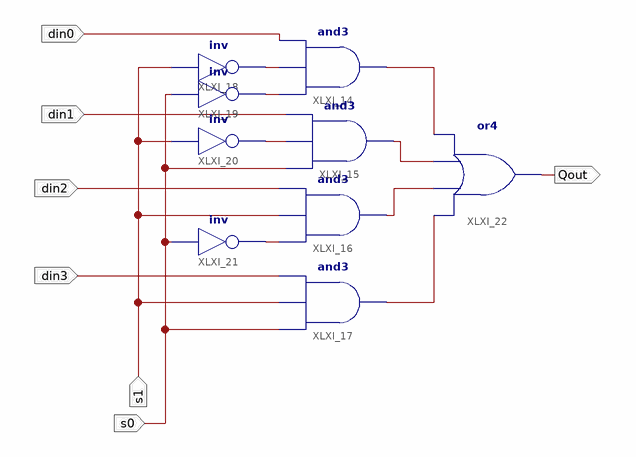
[diagram p0: schematic sheet 1]
// Xilinx ISE schematic four2onemux.sch (spartan3e) as structural Verilog: 9 symbols, 7 ports
module four2onemux (
  input  din1,
  input  din2,
  input  din3,
  input  din0,
  input  s1,
  input  s0,
  output Qout
);

  wire XLXN_16, XLXN_17, XLXN_18, XLXN_19, XLXN_22, XLXN_24, XLXN_25, XLXN_26;

  and XLXI_14 (XLXN_22, XLXN_17, XLXN_16, din0);
  and XLXI_15 (XLXN_24, s0, XLXN_18, din1);
  and XLXI_16 (XLXN_25, XLXN_19, s1, din2);
  and XLXI_17 (XLXN_26, s0, s1, din3);
  not XLXI_18 (XLXN_16, s1);
  not XLXI_19 (XLXN_17, s0);
  not XLXI_20 (XLXN_18, s1);
  not XLXI_21 (XLXN_19, s0);
  or XLXI_22 (Qout, XLXN_26, XLXN_25, XLXN_24, XLXN_22);
endmodule
